# Altium schematic sheet VMEFMC.SchDoc: Simple VME FMC Carrier
size 594 x 420 mm; CheckedBy: T.Janicki; CompanyName: Creotech Instruments SA; DrawnBy: Grzegorz Kasprowicz; Organization: CERN; Address1: European Organization for Nuclear Research; Address2: CH-1211 Geneve 23 - Switzerland; Revision: -; SheetNumber: 1; SheetTotal: 11; EDA_Number: EDA-xxxxx; Projet: Simple VME FMC Carrier; ModifiedBy: -; CreateDate: 20/11/2012; CheckedDate: 23/01/2012; Title2: Top; DivGrp: BE-CO; Designer: Grzegorz Kasprowicz; PageSetup: Record=PageOptions|CenterHorizontal=True|CenterVertical=True|PrintScale=0.67|XCorrection=1.00|YCorrection=1.00|PrintKind=1|BorderSize=5000000|LeftOffset=0|BottomOffset=0|Orientation=2|PaperLength=1000|PaperWidth=1000|Scale=100|PaperSource=15|PrintQuality=600|MediaType=1|DitherType=10|PaperKind=A3|PrintScaleMode=1; ModifiedDate: -; ProjectName: Simple VME FMC Carrier Board
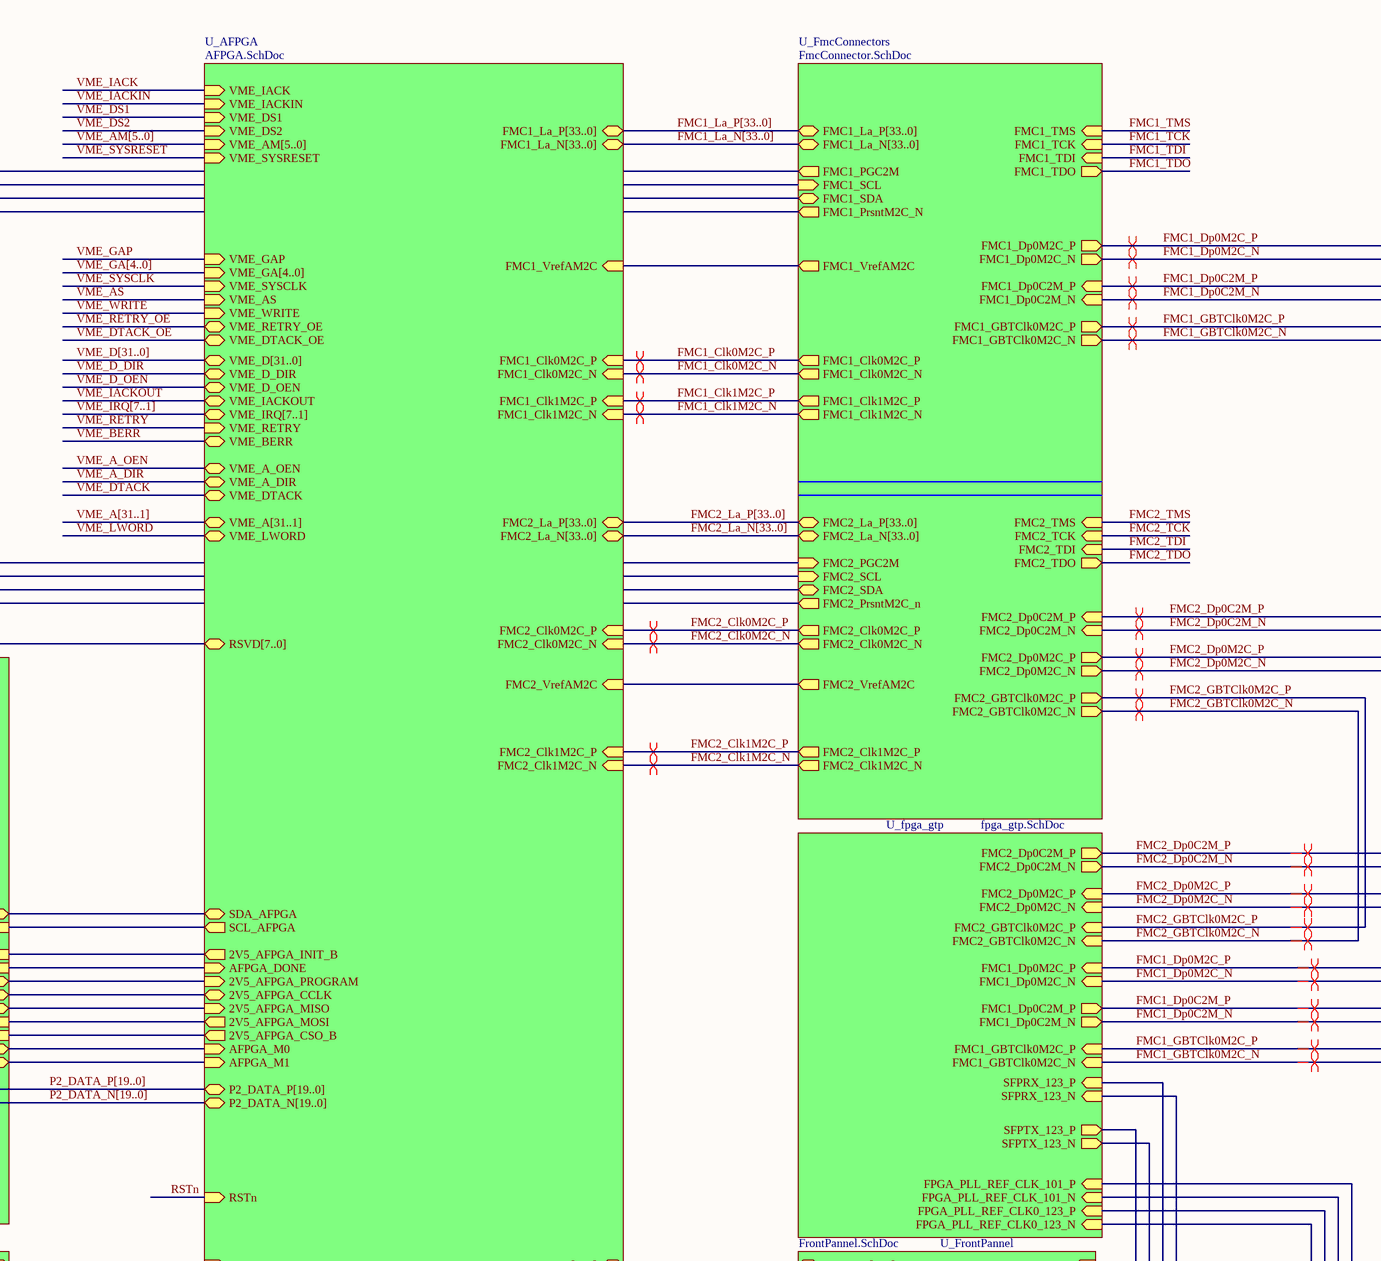
[diagram p0: VMEFMC.SchDoc, top right]
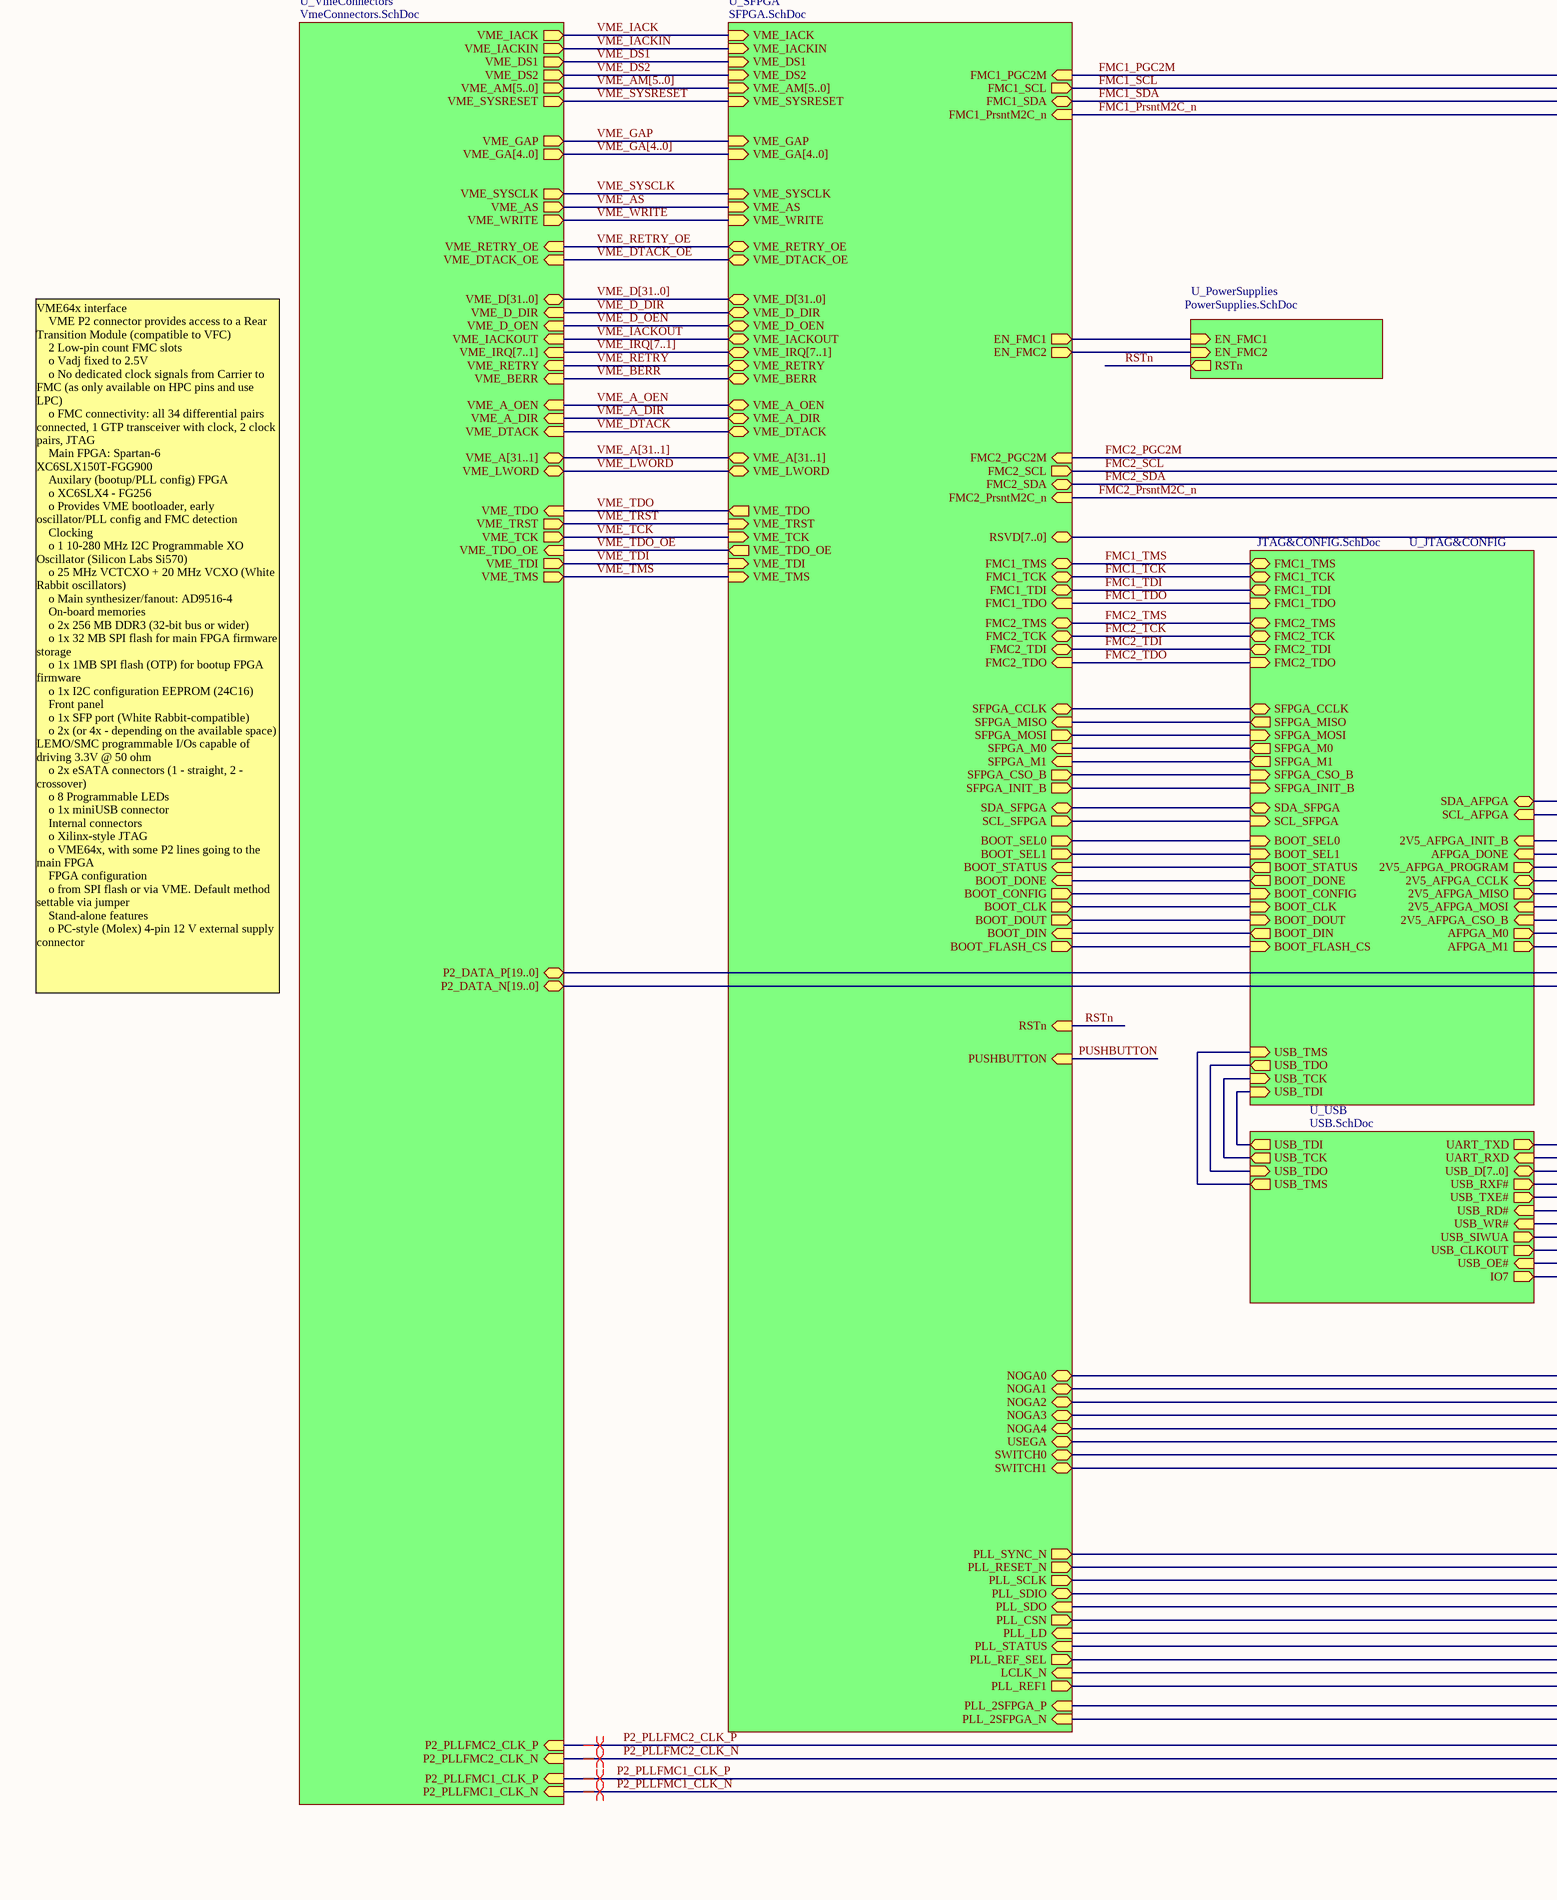
[diagram p1: VMEFMC.SchDoc, bottom left]
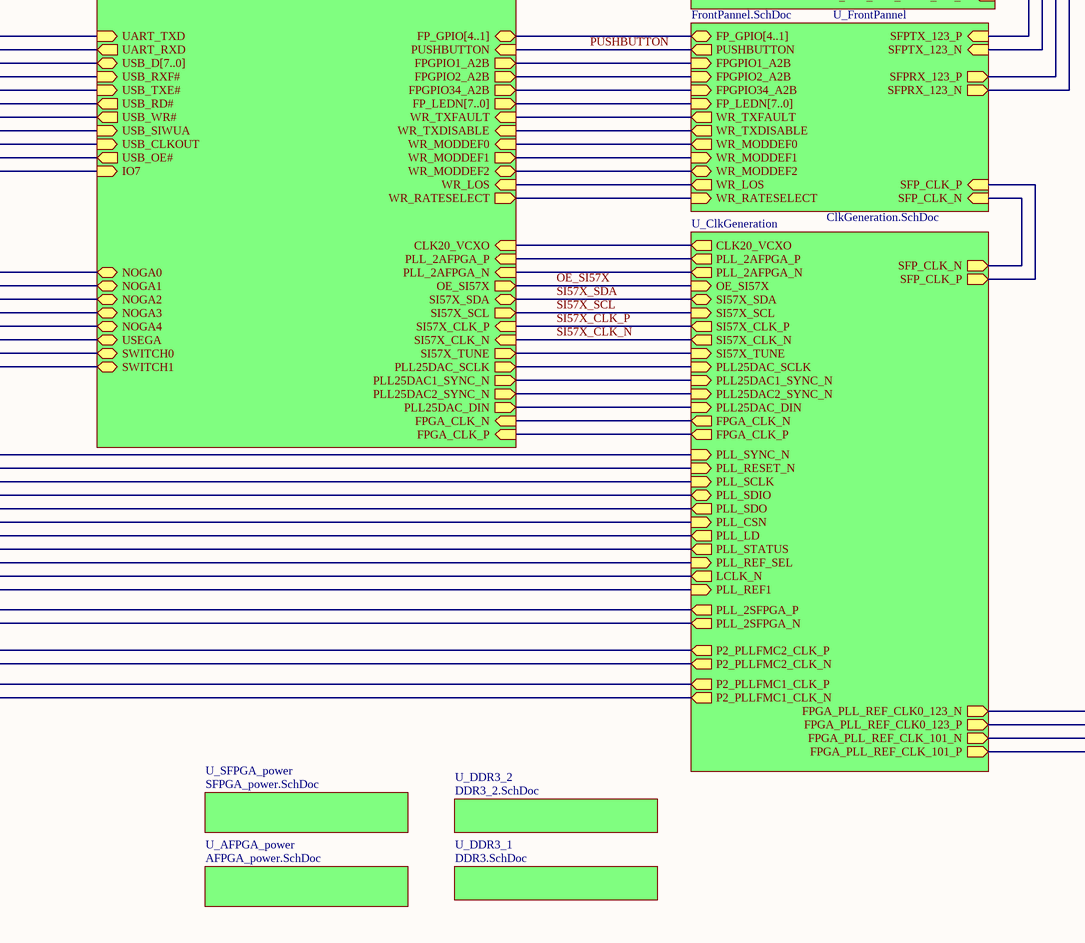
[diagram p2: VMEFMC.SchDoc, bottom right]

## Sub-sheets
U_AFPGA = AFPGA.SchDoc: FMC2_Clk0M2C_P (in), FMC2_Clk0M2C_N (in), FMC2_Clk1M2C_P (in), FMC2_Clk1M2C_N (in), FMC1_Clk0M2C_P (in), FMC1_Clk0M2C_N (in), FMC1_Clk1M2C_P (in), FMC1_Clk1M2C_N (in), FMC2_La_P[33..0] (bidir), FMC2_La_N[33..0] (bidir), FMC1_La_P[33..0] (bidir), FMC1_La_N[33..0] (bidir), VME_IACK (in), VME_IACKIN (in), VME_SYSRESET (in), VME_D_DIR (bidir), VME_D_OEN (bidir), VME_IACKOUT (bidir), VME_RETRY (in), VME_BERR (bidir), VME_A_OEN (bidir), VME_A_DIR (bidir), VME_DTACK (bidir), VME_LWORD (bidir), VME_A[31..1] (bidir), VME_IRQ[7..1] (bidir), VME_D[31..0] (bidir), VME_AM[5..0] (in), VME_DS1 (in), VME_DS2 (in), UART_TXD (in), UART_RXD (out), USB_D[7..0] (bidir), USB_RXF# (in), USB_TXE# (in), USB_RD# (out), USB_WR# (out), USB_SIWUA (in), USB_CLKOUT (in), USB_OE# (out), IO7 (in), RSTn (in), P2_DATA_P[19..0] (bidir), P2_DATA_N[19..0] (bidir), RSVD[7..0] (bidir), AFPGA_DONE (in), AFPGA_M0 (in), AFPGA_M1 (in), VME_RETRY_OE (bidir), VME_DTACK_OE (bidir), VME_SYSCLK (in), VME_AS (in), VME_WRITE (in), VME_GAP (in), VME_GA[4..0] (in), FMC1_VrefAM2C (in), FMC2_VrefAM2C (in), 2V5_AFPGA_CCLK (bidir), 2V5_AFPGA_MISO (in), 2V5_AFPGA_INIT_B (out), 2V5_AFPGA_MOSI (out), 2V5_AFPGA_CSO_B (out), 2V5_AFPGA_PROGRAM (in), PUSHBUTTON (in), WR_TXFAULT (in), WR_TXDISABLE (in), WR_MODDEF0 (in), WR_MODDEF1 (out), WR_MODDEF2 (bidir), WR_LOS (in), WR_RATESELECT (out), FP_LEDN[7..0] (out), FPGPIO1_A2B (out), FPGPIO2_A2B (out), FPGPIO34_A2B (out), FP_GPIO[4..1] (bidir), SDA_AFPGA (bidir), SCL_AFPGA (out), PLL_2AFPGA_P (in), PLL_2AFPGA_N (in), SI57X_SDA (bidir), SI57X_CLK_P (in), SI57X_CLK_N (in), SI57X_SCL (out), OE_SI57X (out), SI57X_TUNE (out), PLL25DAC_SCLK (out), PLL25DAC1_SYNC_N (out), PLL25DAC2_SYNC_N (out), PLL25DAC_DIN (out), CLK20_VCXO (in), FPGA_CLK_P (in), FPGA_CLK_N (in), NOGA0 (bidir), NOGA1 (bidir), NOGA2 (bidir), NOGA3 (bidir), NOGA4 (bidir), USEGA (bidir), SWITCH0 (bidir), SWITCH1 (bidir)
U_AFPGA_power = AFPGA_power.SchDoc: no entries
U_ClkGeneration = ClkGeneration.SchDoc: SFP_CLK_P (out), SFP_CLK_N (out), FPGA_PLL_REF_CLK0_123_N (out), FPGA_PLL_REF_CLK0_123_P (out), FPGA_PLL_REF_CLK_101_N (out), FPGA_PLL_REF_CLK_101_P (out), LCLK_N (out), PLL_2AFPGA_P (out), PLL_2AFPGA_N (out), SI57X_CLK_P (out), SI57X_CLK_N (out), SI57X_SDA (bidir), SI57X_SCL (in), CLK20_VCXO (out), SI57X_TUNE (in), PLL25DAC_SCLK (in), PLL25DAC1_SYNC_N (in), PLL25DAC_DIN (in), PLL25DAC2_SYNC_N (in), OE_SI57X (in), FPGA_CLK_P (out), FPGA_CLK_N (out), PLL_STATUS (out), PLL_REF_SEL (in), PLL_SYNC_N (in), PLL_RESET_N (in), PLL_SCLK (in), PLL_SDIO (bidir), PLL_SDO (out), PLL_CSN (in), PLL_LD (out), PLL_REF1 (in), P2_PLLFMC2_CLK_N (out), P2_PLLFMC2_CLK_P (out), PLL_2SFPGA_P (out), PLL_2SFPGA_N (out), P2_PLLFMC1_CLK_P (out), P2_PLLFMC1_CLK_N (out)
U_DDR3_1 = DDR3.SchDoc: no entries
U_DDR3_2 = DDR3_2.SchDoc: no entries
U_FmcConnectors = FmcConnector.SchDoc: FMC1_La_P[33..0] (bidir), FMC1_La_N[33..0] (bidir), FMC1_TMS (in), FMC1_TCK (in), FMC1_TDI (in), FMC1_TDO (out), FMC2_La_P[33..0] (bidir), FMC2_La_N[33..0] (bidir), FMC2_TMS (in), FMC2_TCK (in), FMC2_TDI (in), FMC2_TDO (out), FMC2_PrsntM2C_n (out), FMC2_Clk0M2C_P (out), FMC2_Clk0M2C_N (out), FMC2_Clk1M2C_P (out), FMC2_Clk1M2C_N (out), FMC2_PGC2M (in), FMC2_SCL (in), FMC2_SDA (bidir), FMC1_Clk0M2C_P (out), FMC1_Clk0M2C_N (out), FMC1_Clk1M2C_P (out), FMC1_Clk1M2C_N (out), FMC1_PGC2M (out), FMC1_SCL (in), FMC1_SDA (bidir), FMC1_PrsntM2C_N (out), FMC2_Dp0C2M_P (in), FMC2_Dp0C2M_N (in), FMC2_Dp0M2C_P (out), FMC2_Dp0M2C_N (out), FMC2_GBTClk0M2C_P (out), FMC2_GBTClk0M2C_N (out), FMC1_GBTClk0M2C_P (out), FMC1_GBTClk0M2C_N (out), FMC1_Dp0C2M_P (in), FMC1_Dp0C2M_N (in), FMC1_Dp0M2C_P (out), FMC1_Dp0M2C_N (out), FMC1_VrefAM2C (out), FMC2_VrefAM2C (out)
U_fpga_gtp = fpga_gtp.SchDoc: SFPTX_123_N (out), SFPTX_123_P (out), SFPRX_123_N (in), SFPRX_123_P (in), FPGA_PLL_REF_CLK_101_P (in), FPGA_PLL_REF_CLK_101_N (in), FPGA_PLL_REF_CLK0_123_P (in), FPGA_PLL_REF_CLK0_123_N (in), FMC1_Dp0C2M_P (out), FMC1_Dp0C2M_N (out), FMC1_Dp0M2C_P (in), FMC1_Dp0M2C_N (in), FMC1_GBTClk0M2C_P (in), FMC1_GBTClk0M2C_N (in), FMC2_Dp0C2M_P (out), FMC2_Dp0C2M_N (out), FMC2_GBTClk0M2C_P (in), FMC2_GBTClk0M2C_N (in), FMC2_Dp0M2C_P (in), FMC2_Dp0M2C_N (in)
U_FrontPannel = FrontPannel.SchDoc: WR_TXFAULT (out), WR_TXDISABLE (out), WR_MODDEF0 (out), WR_MODDEF1 (in), WR_MODDEF2 (bidir), WR_RATESELECT (in), WR_LOS (out), PUSHBUTTON (out), SFP_CLK_P (in), SFP_CLK_N (in), SFPTX_123_P (in), SFPTX_123_N (in), SFPRX_123_P (out), SFPRX_123_N (out), FP_LEDN[7..0] (in), FPGPIO1_A2B (in), FPGPIO2_A2B (in), FPGPIO34_A2B (in), FP_GPIO[4..1] (bidir)
U_JTAG&CONFIG = JTAG&CONFIG.SchDoc: BOOT_SEL0 (in), BOOT_SEL1 (in), BOOT_STATUS (out), BOOT_DONE (out), BOOT_CONFIG (in), BOOT_CLK (in), BOOT_DOUT (in), BOOT_DIN (out), BOOT_FLASH_CS (in), USB_TDI (in), USB_TCK (in), USB_TDO (out), USB_TMS (in), SFPGA_CCLK (bidir), SFPGA_MISO (out), SFPGA_MOSI (in), SFPGA_M0 (out), SFPGA_M1 (out), SFPGA_CSO_B (in), SFPGA_INIT_B (in), FMC1_TDI (bidir), FMC1_TCK (bidir), FMC1_TDO (in), FMC1_TMS (bidir), FMC2_TDI (bidir), FMC2_TCK (bidir), FMC2_TDO (in), FMC2_TMS (bidir), AFPGA_M0 (out), AFPGA_M1 (out), AFPGA_DONE (in), 2V5_AFPGA_CCLK (bidir), 2V5_AFPGA_MISO (out), 2V5_AFPGA_INIT_B (in), 2V5_AFPGA_MOSI (in), 2V5_AFPGA_CSO_B (in), 2V5_AFPGA_PROGRAM (out), SDA_AFPGA (bidir), SDA_SFPGA (bidir), SCL_AFPGA (in), SCL_SFPGA (in)
U_PowerSupplies = PowerSupplies.SchDoc: EN_FMC1 (in), EN_FMC2 (in), RSTn (out)
U_SFPGA = SFPGA.SchDoc: FMC2_SCL (out), VME_TDO_OE (out), VME_IACK (in), VME_IACKIN (in), VME_SYSRESET (in), VME_GAP (in), VME_SYSCLK (in), VME_AS (in), VME_WRITE (in), VME_RETRY_OE (bidir), VME_DTACK_OE (bidir), VME_D_DIR (bidir), VME_D_OEN (bidir), VME_IACKOUT (bidir), VME_RETRY (bidir), VME_BERR (bidir), VME_A_OEN (bidir), VME_A_DIR (bidir), VME_DTACK (bidir), VME_LWORD (bidir), VME_A[31..1] (bidir), VME_IRQ[7..1] (bidir), VME_D[31..0] (bidir), VME_GA[4..0] (in), VME_AM[5..0] (in), FMC2_SDA (bidir), VME_DS1 (in), VME_DS2 (in), FMC2_PGC2M (in), FMC2_PrsntM2C_n (in), VME_TDO (out), VME_TDI (in), VME_TCK (in), VME_TRST (in), VME_TMS (in), BOOT_STATUS (in), BOOT_DONE (in), BOOT_CONFIG (out), BOOT_CLK (out), BOOT_DOUT (out), BOOT_DIN (in), BOOT_FLASH_CS (out), BOOT_SEL0 (out), BOOT_SEL1 (out), SFPGA_CCLK (bidir), SFPGA_MISO (in), SFPGA_MOSI (out), SFPGA_M0 (in), SFPGA_M1 (in), SFPGA_CSO_B (out), SFPGA_INIT_B (out), FMC1_TDI (bidir), FMC1_TCK (bidir), FMC1_TMS (bidir), FMC1_TDO (in), FMC2_TDI (bidir), FMC2_TCK (bidir), FMC2_TMS (bidir), FMC2_TDO (in), RSVD[7..0] (bidir), FMC1_SCL (out), FMC1_SDA (bidir), FMC1_PGC2M (in), FMC1_PrsntM2C_n (in), SCL_SFPGA (out), SDA_SFPGA (bidir), PLL_SYNC_N (out), PLL_RESET_N (out), PLL_SCLK (out), PLL_SDIO (bidir), PLL_SDO (in), PLL_CSN (out), PLL_LD (in), PLL_STATUS (in), PLL_REF_SEL (out), LCLK_N (in), PLL_REF1 (out), PUSHBUTTON (in), RSTn (in), PLL_2SFPGA_P (in), PLL_2SFPGA_N (in), EN_FMC1 (out), EN_FMC2 (out), NOGA0 (bidir), NOGA1 (bidir), NOGA2 (bidir), NOGA3 (bidir), NOGA4 (bidir), USEGA (bidir), SWITCH0 (bidir), SWITCH1 (bidir)
U_SFPGA_power = SFPGA_power.SchDoc: no entries
U_USB = USB.SchDoc: USB_TCK (out), USB_TDI (out), USB_TDO (in), USB_TMS (out), UART_TXD (out), UART_RXD (in), USB_D[7..0] (bidir), USB_RXF# (out), USB_TXE# (out), USB_RD# (in), USB_WR# (in), USB_SIWUA (out), USB_CLKOUT (out), USB_OE# (in), IO7 (out)
U_VmeConnectors = VmeConnectors.SchDoc: VME_IACK (out), VME_IACKIN (out), VME_DS1 (out), VME_DS2 (out), VME_AM[5..0] (out), VME_SYSRESET (out), VME_TCK (out), VME_TRST (out), VME_GAP (out), VME_GA[4..0] (out), VME_TMS (out), VME_TDI (out), VME_SYSCLK (out), VME_AS (out), VME_WRITE (out), VME_D[31..0] (bidir), VME_D_DIR (in), VME_D_OEN (in), VME_IACKOUT (in), VME_IRQ[7..1] (in), VME_RETRY (in), VME_BERR (in), VME_TDO (in), VME_A_OEN (in), VME_A_DIR (in), VME_DTACK (in), VME_A[31..1] (bidir), VME_LWORD (bidir), VME_RETRY_OE (in), VME_DTACK_OE (in), VME_TDO_OE (in), P2_DATA_P[19..0] (bidir), P2_DATA_N[19..0] (bidir), P2_PLLFMC2_CLK_P (in), P2_PLLFMC2_CLK_N (in), P2_PLLFMC1_CLK_P (in), P2_PLLFMC1_CLK_N (in)

## Nets
FMC1_Clk0M2C_N: sheet U_FmcConnectors/FMC1_Clk0M2C_N, sheet U_AFPGA/FMC1_Clk0M2C_N
FMC1_Clk0M2C_P: sheet U_FmcConnectors/FMC1_Clk0M2C_P, sheet U_AFPGA/FMC1_Clk0M2C_P
FMC1_Clk1M2C_N: sheet U_FmcConnectors/FMC1_Clk1M2C_N, sheet U_AFPGA/FMC1_Clk1M2C_N
FMC1_Clk1M2C_P: sheet U_FmcConnectors/FMC1_Clk1M2C_P, sheet U_AFPGA/FMC1_Clk1M2C_P
FMC1_Dp0C2M_N: sheet U_FmcConnectors/FMC1_Dp0C2M_N, sheet U_fpga_gtp/FMC1_Dp0C2M_N
FMC1_Dp0C2M_P: sheet U_FmcConnectors/FMC1_Dp0C2M_P, sheet U_fpga_gtp/FMC1_Dp0C2M_P
FMC1_Dp0M2C_N: sheet U_FmcConnectors/FMC1_Dp0M2C_N, sheet U_fpga_gtp/FMC1_Dp0M2C_N
FMC1_Dp0M2C_P: sheet U_FmcConnectors/FMC1_Dp0M2C_P, sheet U_fpga_gtp/FMC1_Dp0M2C_P
FMC1_GBTClk0M2C_N: sheet U_FmcConnectors/FMC1_GBTClk0M2C_N, sheet U_fpga_gtp/FMC1_GBTClk0M2C_N
FMC1_GBTClk0M2C_P: sheet U_FmcConnectors/FMC1_GBTClk0M2C_P, sheet U_fpga_gtp/FMC1_GBTClk0M2C_P
FMC1_PGC2M: sheet U_SFPGA/FMC1_PGC2M, sheet U_FmcConnectors/FMC1_PGC2M
FMC1_PrsntM2C_n: sheet U_SFPGA/FMC1_PrsntM2C_n, sheet U_FmcConnectors/FMC1_PrsntM2C_N
FMC1_SCL: sheet U_SFPGA/FMC1_SCL, sheet U_FmcConnectors/FMC1_SCL
FMC1_SDA: sheet U_SFPGA/FMC1_SDA, sheet U_FmcConnectors/FMC1_SDA
FMC1_TCK: sheet U_SFPGA/FMC1_TCK, sheet U_FmcConnectors/FMC1_TCK, sheet U_JTAG&CONFIG/FMC1_TCK
FMC1_TDI: sheet U_SFPGA/FMC1_TDI, sheet U_FmcConnectors/FMC1_TDI, sheet U_JTAG&CONFIG/FMC1_TDI
FMC1_TDO: sheet U_SFPGA/FMC1_TDO, sheet U_FmcConnectors/FMC1_TDO, sheet U_JTAG&CONFIG/FMC1_TDO
FMC1_TMS: sheet U_SFPGA/FMC1_TMS, sheet U_FmcConnectors/FMC1_TMS, sheet U_JTAG&CONFIG/FMC1_TMS
FMC2_Clk0M2C_N: sheet U_FmcConnectors/FMC2_Clk0M2C_N, sheet U_AFPGA/FMC2_Clk0M2C_N
FMC2_Clk0M2C_P: sheet U_FmcConnectors/FMC2_Clk0M2C_P, sheet U_AFPGA/FMC2_Clk0M2C_P
FMC2_Clk1M2C_N: sheet U_FmcConnectors/FMC2_Clk1M2C_N, sheet U_AFPGA/FMC2_Clk1M2C_N
FMC2_Clk1M2C_P: sheet U_FmcConnectors/FMC2_Clk1M2C_P, sheet U_AFPGA/FMC2_Clk1M2C_P
FMC2_Dp0C2M_N: sheet U_FmcConnectors/FMC2_Dp0C2M_N, sheet U_fpga_gtp/FMC2_Dp0C2M_N
FMC2_Dp0C2M_P: sheet U_FmcConnectors/FMC2_Dp0C2M_P, sheet U_fpga_gtp/FMC2_Dp0C2M_P
FMC2_Dp0M2C_N: sheet U_FmcConnectors/FMC2_Dp0M2C_N, sheet U_fpga_gtp/FMC2_Dp0M2C_N
FMC2_Dp0M2C_P: sheet U_FmcConnectors/FMC2_Dp0M2C_P, sheet U_fpga_gtp/FMC2_Dp0M2C_P
FMC2_GBTClk0M2C_N: sheet U_FmcConnectors/FMC2_GBTClk0M2C_N, sheet U_fpga_gtp/FMC2_GBTClk0M2C_N
FMC2_GBTClk0M2C_P: sheet U_FmcConnectors/FMC2_GBTClk0M2C_P, sheet U_fpga_gtp/FMC2_GBTClk0M2C_P
FMC2_PGC2M: sheet U_SFPGA/FMC2_PGC2M, sheet U_FmcConnectors/FMC2_PGC2M
FMC2_PrsntM2C_n: sheet U_SFPGA/FMC2_PrsntM2C_n, sheet U_FmcConnectors/FMC2_PrsntM2C_n
FMC2_SCL: sheet U_SFPGA/FMC2_SCL, sheet U_FmcConnectors/FMC2_SCL
FMC2_SDA: sheet U_SFPGA/FMC2_SDA, sheet U_FmcConnectors/FMC2_SDA
FMC2_TCK: sheet U_SFPGA/FMC2_TCK, sheet U_FmcConnectors/FMC2_TCK, sheet U_JTAG&CONFIG/FMC2_TCK
FMC2_TDI: sheet U_SFPGA/FMC2_TDI, sheet U_FmcConnectors/FMC2_TDI, sheet U_JTAG&CONFIG/FMC2_TDI
FMC2_TDO: sheet U_SFPGA/FMC2_TDO, sheet U_FmcConnectors/FMC2_TDO, sheet U_JTAG&CONFIG/FMC2_TDO
FMC2_TMS: sheet U_SFPGA/FMC2_TMS, sheet U_FmcConnectors/FMC2_TMS, sheet U_JTAG&CONFIG/FMC2_TMS
OE_SI57X: sheet U_ClkGeneration/OE_SI57X, sheet U_AFPGA/OE_SI57X
P2_PLLFMC1_CLK_N: sheet U_VmeConnectors/P2_PLLFMC1_CLK_N, sheet U_ClkGeneration/P2_PLLFMC1_CLK_N
P2_PLLFMC1_CLK_P: sheet U_VmeConnectors/P2_PLLFMC1_CLK_P, sheet U_ClkGeneration/P2_PLLFMC1_CLK_P
P2_PLLFMC2_CLK_N: sheet U_VmeConnectors/P2_PLLFMC2_CLK_N, sheet U_ClkGeneration/P2_PLLFMC2_CLK_N
P2_PLLFMC2_CLK_P: sheet U_VmeConnectors/P2_PLLFMC2_CLK_P, sheet U_ClkGeneration/P2_PLLFMC2_CLK_P
PUSHBUTTON: sheet U_FrontPannel/PUSHBUTTON, sheet U_SFPGA/PUSHBUTTON, sheet U_AFPGA/PUSHBUTTON
RSTn: sheet U_SFPGA/RSTn, sheet U_AFPGA/RSTn, sheet U_PowerSupplies/RSTn
SI57X_CLK_N: sheet U_ClkGeneration/SI57X_CLK_N, sheet U_AFPGA/SI57X_CLK_N
SI57X_CLK_P: sheet U_ClkGeneration/SI57X_CLK_P, sheet U_AFPGA/SI57X_CLK_P
SI57X_SCL: sheet U_ClkGeneration/SI57X_SCL, sheet U_AFPGA/SI57X_SCL
SI57X_SDA: sheet U_ClkGeneration/SI57X_SDA, sheet U_AFPGA/SI57X_SDA
VME_A_DIR: sheet U_VmeConnectors/VME_A_DIR, sheet U_SFPGA/VME_A_DIR, sheet U_AFPGA/VME_A_DIR
VME_A_OEN: sheet U_VmeConnectors/VME_A_OEN, sheet U_SFPGA/VME_A_OEN, sheet U_AFPGA/VME_A_OEN
VME_AS: sheet U_VmeConnectors/VME_AS, sheet U_SFPGA/VME_AS, sheet U_AFPGA/VME_AS
VME_BERR: sheet U_VmeConnectors/VME_BERR, sheet U_SFPGA/VME_BERR, sheet U_AFPGA/VME_BERR
VME_D_DIR: sheet U_VmeConnectors/VME_D_DIR, sheet U_SFPGA/VME_D_DIR, sheet U_AFPGA/VME_D_DIR
VME_D_OEN: sheet U_VmeConnectors/VME_D_OEN, sheet U_SFPGA/VME_D_OEN, sheet U_AFPGA/VME_D_OEN
VME_DS1: sheet U_VmeConnectors/VME_DS1, sheet U_SFPGA/VME_DS1, sheet U_AFPGA/VME_DS1
VME_DS2: sheet U_VmeConnectors/VME_DS2, sheet U_SFPGA/VME_DS2, sheet U_AFPGA/VME_DS2
VME_DTACK: sheet U_VmeConnectors/VME_DTACK, sheet U_SFPGA/VME_DTACK, sheet U_AFPGA/VME_DTACK
VME_DTACK_OE: sheet U_VmeConnectors/VME_DTACK_OE, sheet U_SFPGA/VME_DTACK_OE, sheet U_AFPGA/VME_DTACK_OE
VME_GAP: sheet U_VmeConnectors/VME_GAP, sheet U_SFPGA/VME_GAP, sheet U_AFPGA/VME_GAP
VME_IACK: sheet U_VmeConnectors/VME_IACK, sheet U_SFPGA/VME_IACK, sheet U_AFPGA/VME_IACK
VME_IACKIN: sheet U_VmeConnectors/VME_IACKIN, sheet U_SFPGA/VME_IACKIN, sheet U_AFPGA/VME_IACKIN
VME_IACKOUT: sheet U_VmeConnectors/VME_IACKOUT, sheet U_SFPGA/VME_IACKOUT, sheet U_AFPGA/VME_IACKOUT
VME_LWORD: sheet U_VmeConnectors/VME_LWORD, sheet U_SFPGA/VME_LWORD, sheet U_AFPGA/VME_LWORD
VME_RETRY: sheet U_VmeConnectors/VME_RETRY, sheet U_SFPGA/VME_RETRY, sheet U_AFPGA/VME_RETRY
VME_RETRY_OE: sheet U_VmeConnectors/VME_RETRY_OE, sheet U_SFPGA/VME_RETRY_OE, sheet U_AFPGA/VME_RETRY_OE
VME_SYSCLK: sheet U_VmeConnectors/VME_SYSCLK, sheet U_SFPGA/VME_SYSCLK, sheet U_AFPGA/VME_SYSCLK
VME_SYSRESET: sheet U_VmeConnectors/VME_SYSRESET, sheet U_SFPGA/VME_SYSRESET, sheet U_AFPGA/VME_SYSRESET
VME_TCK: sheet U_VmeConnectors/VME_TCK, sheet U_SFPGA/VME_TCK
VME_TDI: sheet U_VmeConnectors/VME_TDI, sheet U_SFPGA/VME_TDI
VME_TDO: sheet U_VmeConnectors/VME_TDO, sheet U_SFPGA/VME_TDO
VME_TDO_OE: sheet U_VmeConnectors/VME_TDO_OE, sheet U_SFPGA/VME_TDO_OE
VME_TMS: sheet U_VmeConnectors/VME_TMS, sheet U_SFPGA/VME_TMS
VME_TRST: sheet U_VmeConnectors/VME_TRST, sheet U_SFPGA/VME_TRST
VME_WRITE: sheet U_VmeConnectors/VME_WRITE, sheet U_SFPGA/VME_WRITE, sheet U_AFPGA/VME_WRITE
(unnamed): sheet U_FrontPannel/WR_TXFAULT, sheet U_AFPGA/WR_TXFAULT
(unnamed): sheet U_FrontPannel/WR_TXDISABLE, sheet U_AFPGA/WR_TXDISABLE
(unnamed): sheet U_FrontPannel/WR_MODDEF0, sheet U_AFPGA/WR_MODDEF0
(unnamed): sheet U_FrontPannel/WR_MODDEF1, sheet U_AFPGA/WR_MODDEF1
(unnamed): sheet U_FrontPannel/WR_MODDEF2, sheet U_AFPGA/WR_MODDEF2
(unnamed): sheet U_FrontPannel/WR_RATESELECT, sheet U_AFPGA/WR_RATESELECT
(unnamed): sheet U_FrontPannel/WR_LOS, sheet U_AFPGA/WR_LOS
(unnamed): sheet U_FrontPannel/SFP_CLK_P, sheet U_ClkGeneration/SFP_CLK_P
(unnamed): sheet U_FrontPannel/SFP_CLK_N, sheet U_ClkGeneration/SFP_CLK_N
(unnamed): sheet U_FrontPannel/SFPTX_123_P, sheet U_fpga_gtp/SFPTX_123_P
(unnamed): sheet U_FrontPannel/SFPTX_123_N, sheet U_fpga_gtp/SFPTX_123_N
(unnamed): sheet U_FrontPannel/SFPRX_123_P, sheet U_fpga_gtp/SFPRX_123_P
(unnamed): sheet U_FrontPannel/SFPRX_123_N, sheet U_fpga_gtp/SFPRX_123_N
(unnamed): sheet U_FrontPannel/FPGPIO1_A2B, sheet U_AFPGA/FPGPIO1_A2B
(unnamed): sheet U_FrontPannel/FPGPIO2_A2B, sheet U_AFPGA/FPGPIO2_A2B
(unnamed): sheet U_FrontPannel/FPGPIO34_A2B, sheet U_AFPGA/FPGPIO34_A2B
(unnamed): sheet U_SFPGA/BOOT_STATUS, sheet U_JTAG&CONFIG/BOOT_STATUS
(unnamed): sheet U_SFPGA/BOOT_DONE, sheet U_JTAG&CONFIG/BOOT_DONE
(unnamed): sheet U_SFPGA/BOOT_CONFIG, sheet U_JTAG&CONFIG/BOOT_CONFIG
(unnamed): sheet U_SFPGA/BOOT_CLK, sheet U_JTAG&CONFIG/BOOT_CLK
(unnamed): sheet U_SFPGA/BOOT_DOUT, sheet U_JTAG&CONFIG/BOOT_DOUT
(unnamed): sheet U_SFPGA/BOOT_DIN, sheet U_JTAG&CONFIG/BOOT_DIN
(unnamed): sheet U_SFPGA/BOOT_FLASH_CS, sheet U_JTAG&CONFIG/BOOT_FLASH_CS
(unnamed): sheet U_SFPGA/BOOT_SEL0, sheet U_JTAG&CONFIG/BOOT_SEL0
(unnamed): sheet U_SFPGA/BOOT_SEL1, sheet U_JTAG&CONFIG/BOOT_SEL1
(unnamed): sheet U_SFPGA/SFPGA_CCLK, sheet U_JTAG&CONFIG/SFPGA_CCLK
(unnamed): sheet U_SFPGA/SFPGA_MISO, sheet U_JTAG&CONFIG/SFPGA_MISO
(unnamed): sheet U_SFPGA/SFPGA_MOSI, sheet U_JTAG&CONFIG/SFPGA_MOSI
(unnamed): sheet U_SFPGA/SFPGA_M0, sheet U_JTAG&CONFIG/SFPGA_M0
(unnamed): sheet U_SFPGA/SFPGA_M1, sheet U_JTAG&CONFIG/SFPGA_M1
(unnamed): sheet U_SFPGA/SFPGA_CSO_B, sheet U_JTAG&CONFIG/SFPGA_CSO_B
(unnamed): sheet U_SFPGA/SFPGA_INIT_B, sheet U_JTAG&CONFIG/SFPGA_INIT_B
(unnamed): sheet U_SFPGA/SCL_SFPGA, sheet U_JTAG&CONFIG/SCL_SFPGA
(unnamed): sheet U_SFPGA/SDA_SFPGA, sheet U_JTAG&CONFIG/SDA_SFPGA
(unnamed): sheet U_SFPGA/PLL_SYNC_N, sheet U_ClkGeneration/PLL_SYNC_N
(unnamed): sheet U_SFPGA/PLL_RESET_N, sheet U_ClkGeneration/PLL_RESET_N
(unnamed): sheet U_SFPGA/PLL_SCLK, sheet U_ClkGeneration/PLL_SCLK
(unnamed): sheet U_SFPGA/PLL_SDIO, sheet U_ClkGeneration/PLL_SDIO
(unnamed): sheet U_SFPGA/PLL_SDO, sheet U_ClkGeneration/PLL_SDO
(unnamed): sheet U_SFPGA/PLL_CSN, sheet U_ClkGeneration/PLL_CSN
(unnamed): sheet U_SFPGA/PLL_LD, sheet U_ClkGeneration/PLL_LD
(unnamed): sheet U_SFPGA/PLL_STATUS, sheet U_ClkGeneration/PLL_STATUS
(unnamed): sheet U_SFPGA/PLL_REF_SEL, sheet U_ClkGeneration/PLL_REF_SEL
(unnamed): sheet U_SFPGA/LCLK_N, sheet U_ClkGeneration/LCLK_N
(unnamed): sheet U_SFPGA/PLL_REF1, sheet U_ClkGeneration/PLL_REF1
(unnamed): sheet U_SFPGA/PLL_2SFPGA_P, sheet U_ClkGeneration/PLL_2SFPGA_P
(unnamed): sheet U_SFPGA/PLL_2SFPGA_N, sheet U_ClkGeneration/PLL_2SFPGA_N
(unnamed): sheet U_SFPGA/EN_FMC1, sheet U_PowerSupplies/EN_FMC1
(unnamed): sheet U_SFPGA/EN_FMC2, sheet U_PowerSupplies/EN_FMC2
(unnamed): sheet U_SFPGA/NOGA0, sheet U_AFPGA/NOGA0
(unnamed): sheet U_SFPGA/NOGA1, sheet U_AFPGA/NOGA1
(unnamed): sheet U_SFPGA/NOGA2, sheet U_AFPGA/NOGA2
(unnamed): sheet U_SFPGA/NOGA3, sheet U_AFPGA/NOGA3
(unnamed): sheet U_SFPGA/NOGA4, sheet U_AFPGA/NOGA4
(unnamed): sheet U_SFPGA/USEGA, sheet U_AFPGA/USEGA
(unnamed): sheet U_SFPGA/SWITCH0, sheet U_AFPGA/SWITCH0
(unnamed): sheet U_SFPGA/SWITCH1, sheet U_AFPGA/SWITCH1
(unnamed): sheet U_ClkGeneration/FPGA_PLL_REF_CLK0_123_N, sheet U_fpga_gtp/FPGA_PLL_REF_CLK0_123_N
(unnamed): sheet U_ClkGeneration/FPGA_PLL_REF_CLK0_123_P, sheet U_fpga_gtp/FPGA_PLL_REF_CLK0_123_P
(unnamed): sheet U_ClkGeneration/FPGA_PLL_REF_CLK_101_N, sheet U_fpga_gtp/FPGA_PLL_REF_CLK_101_N
(unnamed): sheet U_ClkGeneration/FPGA_PLL_REF_CLK_101_P, sheet U_fpga_gtp/FPGA_PLL_REF_CLK_101_P
(unnamed): sheet U_ClkGeneration/PLL_2AFPGA_P, sheet U_AFPGA/PLL_2AFPGA_P
(unnamed): sheet U_ClkGeneration/PLL_2AFPGA_N, sheet U_AFPGA/PLL_2AFPGA_N
(unnamed): sheet U_ClkGeneration/CLK20_VCXO, sheet U_AFPGA/CLK20_VCXO
(unnamed): sheet U_ClkGeneration/SI57X_TUNE, sheet U_AFPGA/SI57X_TUNE
(unnamed): sheet U_ClkGeneration/PLL25DAC_SCLK, sheet U_AFPGA/PLL25DAC_SCLK
(unnamed): sheet U_ClkGeneration/PLL25DAC1_SYNC_N, sheet U_AFPGA/PLL25DAC1_SYNC_N
(unnamed): sheet U_ClkGeneration/PLL25DAC_DIN, sheet U_AFPGA/PLL25DAC_DIN
(unnamed): sheet U_ClkGeneration/PLL25DAC2_SYNC_N, sheet U_AFPGA/PLL25DAC2_SYNC_N
(unnamed): sheet U_ClkGeneration/FPGA_CLK_P, sheet U_AFPGA/FPGA_CLK_P
(unnamed): sheet U_ClkGeneration/FPGA_CLK_N, sheet U_AFPGA/FPGA_CLK_N
(unnamed): sheet U_FmcConnectors/FMC1_VrefAM2C, sheet U_AFPGA/FMC1_VrefAM2C
(unnamed): sheet U_FmcConnectors/FMC2_VrefAM2C, sheet U_AFPGA/FMC2_VrefAM2C
(unnamed): sheet U_JTAG&CONFIG/USB_TDI, sheet U_USB/USB_TDI
(unnamed): sheet U_JTAG&CONFIG/USB_TCK, sheet U_USB/USB_TCK
(unnamed): sheet U_JTAG&CONFIG/USB_TDO, sheet U_USB/USB_TDO
(unnamed): sheet U_JTAG&CONFIG/USB_TMS, sheet U_USB/USB_TMS
(unnamed): sheet U_JTAG&CONFIG/AFPGA_M0, sheet U_AFPGA/AFPGA_M0
(unnamed): sheet U_JTAG&CONFIG/AFPGA_M1, sheet U_AFPGA/AFPGA_M1
(unnamed): sheet U_JTAG&CONFIG/AFPGA_DONE, sheet U_AFPGA/AFPGA_DONE
(unnamed): sheet U_JTAG&CONFIG/2V5_AFPGA_CCLK, sheet U_AFPGA/2V5_AFPGA_CCLK
(unnamed): sheet U_JTAG&CONFIG/2V5_AFPGA_MISO, sheet U_AFPGA/2V5_AFPGA_MISO
(unnamed): sheet U_JTAG&CONFIG/2V5_AFPGA_INIT_B, sheet U_AFPGA/2V5_AFPGA_INIT_B
(unnamed): sheet U_JTAG&CONFIG/2V5_AFPGA_MOSI, sheet U_AFPGA/2V5_AFPGA_MOSI
(unnamed): sheet U_JTAG&CONFIG/2V5_AFPGA_CSO_B, sheet U_AFPGA/2V5_AFPGA_CSO_B
(unnamed): sheet U_JTAG&CONFIG/2V5_AFPGA_PROGRAM, sheet U_AFPGA/2V5_AFPGA_PROGRAM
(unnamed): sheet U_JTAG&CONFIG/SDA_AFPGA, sheet U_AFPGA/SDA_AFPGA
(unnamed): sheet U_JTAG&CONFIG/SCL_AFPGA, sheet U_AFPGA/SCL_AFPGA
(unnamed): sheet U_USB/UART_TXD, sheet U_AFPGA/UART_TXD
(unnamed): sheet U_USB/UART_RXD, sheet U_AFPGA/UART_RXD
(unnamed): sheet U_USB/USB_RXF#, sheet U_AFPGA/USB_RXF#
(unnamed): sheet U_USB/USB_TXE#, sheet U_AFPGA/USB_TXE#
(unnamed): sheet U_USB/USB_RD#, sheet U_AFPGA/USB_RD#
(unnamed): sheet U_USB/USB_WR#, sheet U_AFPGA/USB_WR#
(unnamed): sheet U_USB/USB_SIWUA, sheet U_AFPGA/USB_SIWUA
(unnamed): sheet U_USB/USB_CLKOUT, sheet U_AFPGA/USB_CLKOUT
(unnamed): sheet U_USB/USB_OE#, sheet U_AFPGA/USB_OE#
(unnamed): sheet U_USB/IO7, sheet U_AFPGA/IO7

## Buses and harness runs
bus FMC1_La_N[33..0] = sheet U_AFPGA/FMC1_La_N[33..0] = sheet U_FmcConnectors/FMC1_La_N[33..0]
bus FMC1_La_P[33..0] = sheet U_AFPGA/FMC1_La_P[33..0] = sheet U_FmcConnectors/FMC1_La_P[33..0]
bus FMC2_La_N[33..0] = sheet U_AFPGA/FMC2_La_N[33..0] = sheet U_FmcConnectors/FMC2_La_N[33..0]
bus FMC2_La_P[33..0] = sheet U_AFPGA/FMC2_La_P[33..0] = sheet U_FmcConnectors/FMC2_La_P[33..0]
bus P2_DATA_N[19..0] = sheet U_AFPGA/P2_DATA_N[19..0] = sheet U_VmeConnectors/P2_DATA_N[19..0]
bus P2_DATA_P[19..0] = sheet U_AFPGA/P2_DATA_P[19..0] = sheet U_VmeConnectors/P2_DATA_P[19..0]
bus sheet U_AFPGA/FP_GPIO[4..1] = sheet U_FrontPannel/FP_GPIO[4..1]
bus sheet U_AFPGA/FP_LEDN[7..0] = sheet U_FrontPannel/FP_LEDN[7..0]
bus sheet U_AFPGA/RSVD[7..0] = sheet U_SFPGA/RSVD[7..0]
bus sheet U_AFPGA/USB_D[7..0] = sheet U_USB/USB_D[7..0]
bus VME_A[31..1] = sheet U_AFPGA/VME_A[31..1]
bus VME_A[31..1] = sheet U_SFPGA/VME_A[31..1] = sheet U_VmeConnectors/VME_A[31..1]
bus VME_AM[5..0] = sheet U_AFPGA/VME_AM[5..0]
bus VME_AM[5..0] = sheet U_SFPGA/VME_AM[5..0] = sheet U_VmeConnectors/VME_AM[5..0]
bus VME_D[31..0] = sheet U_AFPGA/VME_D[31..0]
bus VME_D[31..0] = sheet U_SFPGA/VME_D[31..0] = sheet U_VmeConnectors/VME_D[31..0]
bus VME_GA[4..0] = sheet U_AFPGA/VME_GA[4..0]
bus VME_GA[4..0] = sheet U_SFPGA/VME_GA[4..0] = sheet U_VmeConnectors/VME_GA[4..0]
bus VME_IRQ[7..1] = sheet U_AFPGA/VME_IRQ[7..1]
bus VME_IRQ[7..1] = sheet U_SFPGA/VME_IRQ[7..1] = sheet U_VmeConnectors/VME_IRQ[7..1]

## Layout directives
differential pair: FMC1_Clk0M2C_N, FMC1_Clk0M2C_P, FMC1_Clk1M2C_N, FMC1_Clk1M2C_P, FMC1_Dp0C2M_N, FMC1_Dp0C2M_P, FMC1_Dp0M2C_N, FMC1_Dp0M2C_P, FMC1_GBTClk0M2C_N, FMC1_GBTClk0M2C_P, FMC2_Clk0M2C_N, FMC2_Clk0M2C_P, FMC2_Clk1M2C_N, FMC2_Clk1M2C_P, FMC2_Dp0C2M_N, FMC2_Dp0C2M_P, FMC2_Dp0M2C_N, FMC2_Dp0M2C_P, FMC2_GBTClk0M2C_N, FMC2_GBTClk0M2C_P, P2_PLLFMC1_CLK_N, P2_PLLFMC1_CLK_P, P2_PLLFMC2_CLK_N, P2_PLLFMC2_CLK_P

## Notes on the sheet
- VME64x interface
  VME P2 connector provides access to a Rear Transition Module (compatible to VFC)
  2 Low-pin count FMC slots
  o Vadj fixed to 2.5V
  o No dedicated clock signals from Carrier to FMC (as only available on HPC pins and use LPC)
  o FMC connectivity: all 34 differential pairs connected, 1 GTP transceiver with clock, 2 clock pairs, JTAG
  Main FPGA: Spartan-6 XC6SLX150T-FGG900
  Auxilary (bootup/PLL config) FPGA
  o XC6SLX4 - FG256
  o Provides VME bootloader, early oscillator/PLL config and FMC detection
  Clocking
  o 1 10-280 MHz I2C Programmable XO Oscillator (Silicon Labs Si570)
  o 25 MHz VCTCXO + 20 MHz VCXO (White Rabbit oscillators)
  o Main synthesizer/fanout: AD9516-4
  On-board memories
  o 2x 256 MB DDR3 (32-bit bus or wider)
  o 1x 32 MB SPI flash for main FPGA firmware storage
  o 1x 1MB SPI flash (OTP) for bootup FPGA firmware
  o 1x I2C configuration EEPROM (24C16)
  Front panel
  o 1x SFP port (White Rabbit-compatible)
  o 2x (or 4x - depending on the available space) LEMO/SMC programmable I/Os capable of driving 3.3V @ 50 ohm
  o 2x eSATA connectors (1 - straight, 2 - crossover)
  o 8 Programmable LEDs
  o 1x miniUSB connector
  Internal connectors
  o Xilinx-style JTAG
  o VME64x, with some P2 lines going to the main FPGA
  FPGA configuration
  o from SPI flash or via VME. Default method settable via jumper
  Stand-alone features
  o PC-style (Molex) 4-pin 12 V external supply connector
- Project/Equipment
- Document
- File
- Designer
- Drawn by
- Check.by
- Last Mod.
- Print Date
- Sheet
- Size
- A2
- of
- Rev